# Altium project SERIALIO.PRJPCB
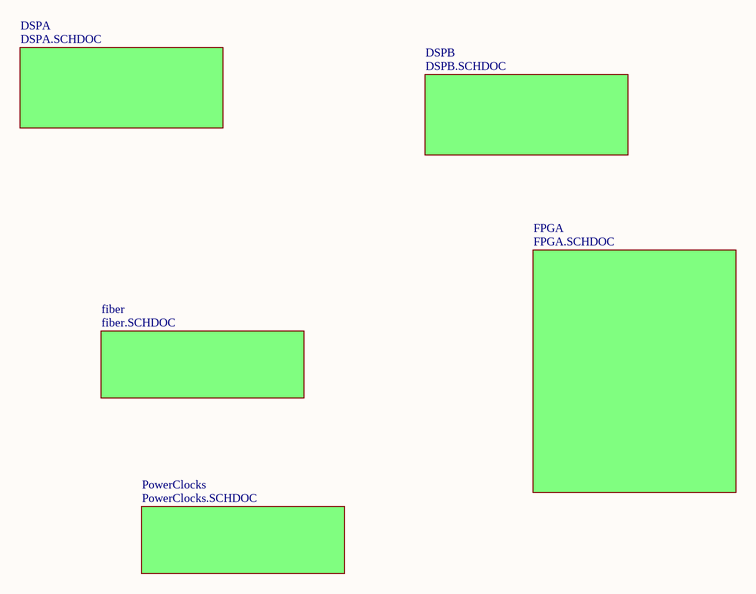
[diagram p0: main.SCHDOC]
4 sheets, 101 parts. Net scope: global (net labels, ports and power ports of the same name join across sheets).
Board file: SerialIO.PCBDOC
Sheets:
  main.SCHDOC
    fiber = fiber.SCHDOC
    FPGA = FPGA.SCHDOC
    PowerClocks = PowerClocks.SCHDOC

## Sheet main.SCHDOC
size B

### Sub-sheets
DSPA = DSPA.SCHDOC (file not in this document): no entries
DSPB = DSPB.SCHDOC (file not in this document): no entries
fiber = fiber.SCHDOC: no entries
FPGA = FPGA.SCHDOC: no entries
PowerClocks = PowerClocks.SCHDOC: no entries

### Notes on the sheet
- Title:
- Engineer:
- Date:
- Revision:
- Sheet
- of
- File:

## Sheet fiber.SCHDOC
size B
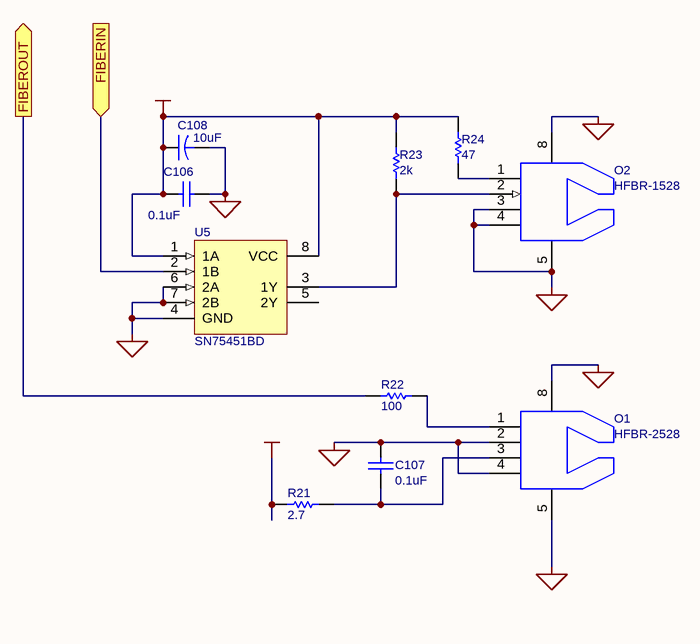
[diagram p1: fiber.SCHDOC]

### Parts
C106  value 0.1uF  [CC1005-0402]  (hidden comment: Cap)
C107  value 0.1uF  [CC1005-0402]  (hidden comment: Cap)
C108  value 10uF  [TC3528-1411]
O1  HFBR-2528  [HPVL]
O2  HFBR-1528  [HPVL]
R21  value 2.7  [CR1608-0603]  (hidden comment: Res1)
R22  value 100  [CR1608-0603]  (hidden comment: Res1)
R23  value 2k  [CR1608-0603]  (hidden comment: Res1)
R24  value 47  [CR1608-0603]  (hidden comment: Res1)
U5  SN75451BD  [SO-G8/E2.5]

### Ports
FIBERIN (in), FIBEROUT (out)

### Nets
+5VCC: C106.1 C108.1 R21.1 R23.2 R24.2 U5.1(1A) U5.8(VCC)
GND: C106.2 C107.2 C108.2 O1.2 O1.4 O1.5 O1.8 O2.3 O2.4 O2.5 O2.8 U5.4(GND) U5.6(2A) U5.7(2B)
NetC107_1: C107.1 O1.3 R21.2
NetO1_1: O1.1 R22.2
NetO2_1: O2.1 R24.1
NetO2_2: O2.2 R23.1 U5.3(1Y)
NetR22_1: R22.1 ; port FIBEROUT
NetU1_50: U5.2(1B) ; port FIBERIN

Not connected (* = marked no-connect by the designer): U5 5(2Y)

### Notes on the sheet
- Title:
- Engineer:
- Date:
- Revision:
- Sheet
- of
- File:

### Library data of the parts
C106 C107 = Cap: Capacitor; Manufacturer: Generic Components; Class I: Passive; Published: 8-Jun-2000; Revision: July-2002: Re-released for DXP Platform.; Publisher: Altium Limited; Class II: Capacitor
C108 = Cap2: Capacitor; Manufacturer: Generic Components; Class I: Passive; Published: 23-Sep-2002; Publisher: Altium Limited; Class II: Capacitor
O1 = HFBR-2528: Low-cost fiber receiver
O2 = HFBR-1528: Low-cost fiber transmitter
R21-R24 = Res1: Resistor; Manufacturer: Generic Components; Class I: Passive; Published: 8-Jun-2000; Revision: July-2002: Re-released for DXP Platform.; Publisher: Altium Limited; Class II: Resistor
U5 = SN75451BD: Dual Peripheral Driver; Manufacturer: Texas Instruments; Package Information: Latest Revision: Jan-1998; Class I: Interface; Published: 15-May-2002; Datasheet: 1991 Interface Circuits Data Book (May-1990); Package Reference: D008; Publisher: Altium Limited; Class II: Peripheral Driver

## Sheet FPGA.SCHDOC
size B
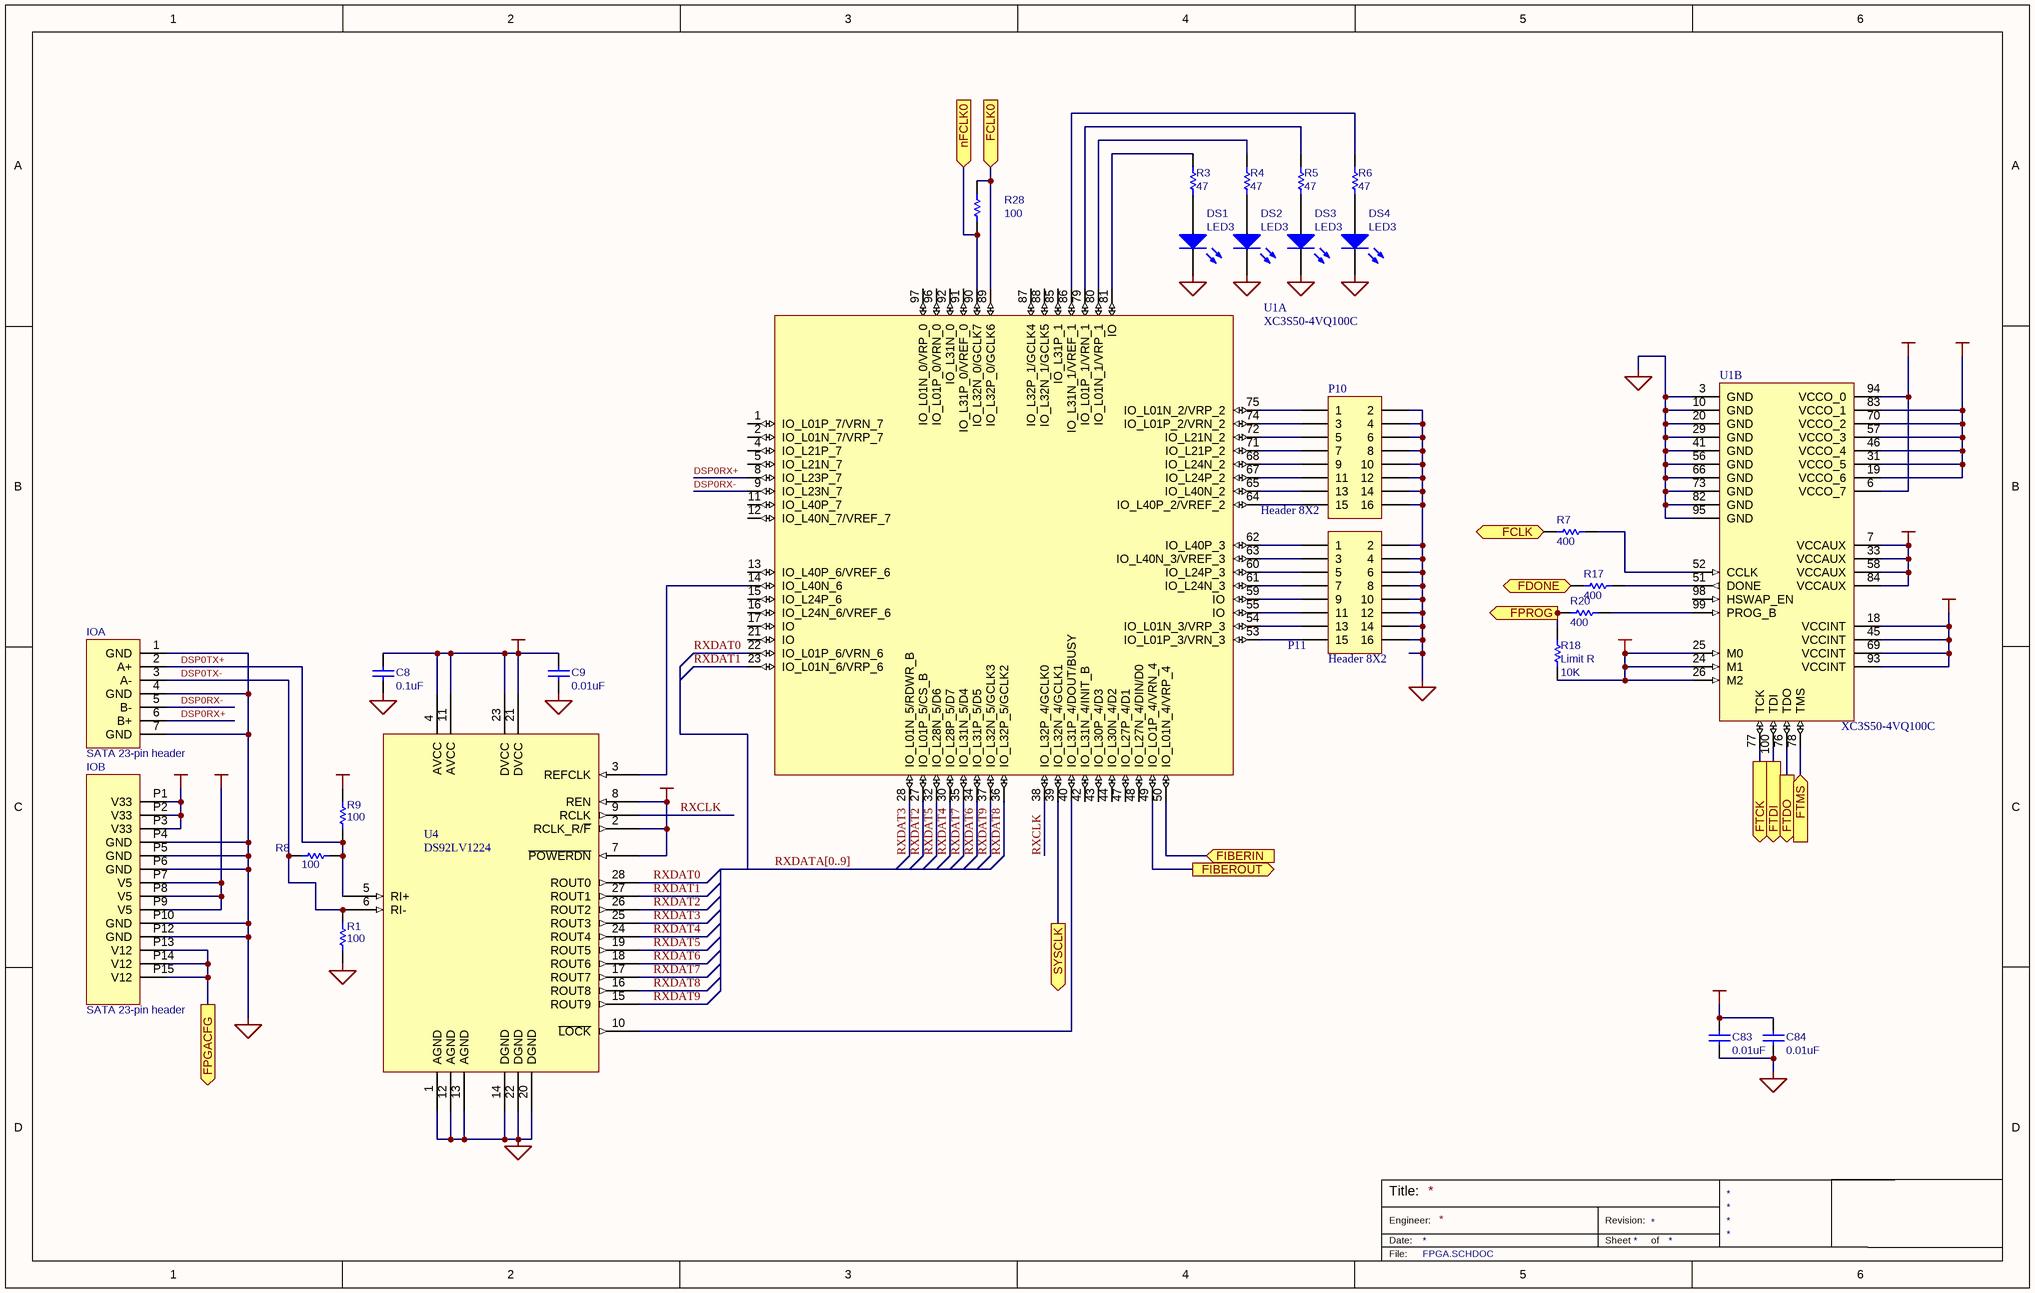
[diagram p2: FPGA.SCHDOC]

### Parts
C8  value 0.1uF  [CC1005-0402]  (hidden comment: Cap)
C9  value 0.01uF  [CC1005-0402]  (hidden comment: Cap)
C83  value 0.01uF  [CC1005-0402]  (hidden comment: Cap)
C84  value 0.01uF  [CC1005-0402]  (hidden comment: Cap)
DS1  LED3  [SMD _LED]
DS2  LED3  [SMD _LED]
DS3  LED3  [SMD _LED]
DS4  LED3  [SMD _LED]
IO  SATA 23-pin header  [MOLEX 87703-0001]  (parts A,B of 2)
P10  Header 8X2  [HDR2X8]
P11  Header 8X2  [HDR2X8]
R1  100  [CR1005-0402]
R3  value 47  [CR1608-0603]  (hidden comment: Res1)
R4  value 47  [CR1608-0603]  (hidden comment: Res1)
R5  value 47  [CR1608-0603]  (hidden comment: Res1)
R6  value 47  [CR1608-0603]  (hidden comment: Res1)
R7  value 400  [CR1608-0603]  (hidden comment: Res1)
R8  100  [CR1005-0402]
R9  100  [CR1005-0402]
R17  value 400  [CR1608-0603]  (hidden comment: Res1)
R18  Limit R  value 10K  [CR1608-0603]
R20  value 400  [CR1608-0603]  (hidden comment: Res1)
R28  100  [CR1005-0402]
U1  XC3S50-4VQ100C  [Xilinx TQ100]  (parts A,B of 2)
U4  DS92LV1224  [SSO-G28/E4.3]

### Ports
FCLK0 (in), FCLK (out), FDONE (out), FIBERIN (in), FIBEROUT (out), FPGACFG (out), FPROG (out), FTCK (out), FTDI (out), FTDO (out), FTMS (in), nFCLK0 (in), SYSCLK (out)

### Nets
+1.2VCC: U1.18(VCCINT) U1.45(VCCINT) U1.69(VCCINT) U1.93(VCCINT)
+2.5VCC: U1.6(VCCO_7) U1.7(VCCAUX) U1.33(VCCAUX) U1.58(VCCAUX) U1.84(VCCAUX) U1.94(VCCO_0)
+5VCC: IO.P7(V5) IO.P8(V5) IO.P9(V5)
GND: C8.1 C9.1 C83.1 C84.1 DS1.2(K) DS2.2(K) DS3.2(K) DS4.2(K) IO.1(GND) IO.4(GND) IO.7(GND) IO.P4(GND) IO.P5(GND) IO.P6(GND) IO.P10(GND) IO.P12(GND) P10.2 P10.4 P10.6 P10.8 P10.10 P10.12 P10.14 P10.16 P11.2 P11.4 P11.6 P11.8 P11.10 P11.12 P11.14 P11.16 R1.1 U1.3(GND) U1.10(GND) U1.20(GND) U1.29(GND) U1.41(GND) U1.56(GND) U1.66(GND) U1.73(GND) U1.82(GND) U1.95(GND) U4.1(AGND) U4.12(AGND) U4.13(AGND) U4.14(DGND) U4.20(DGND) U4.22(DGND)
VCC: C8.2 C9.2 C83.2 C84.2 IO.P1(V33) IO.P2(V33) IO.P3(V33) R9.1 R18.2 U1.19(VCCO_6) U1.24(M1) U1.25(M0) U1.26(M2) U1.31(VCCO_5) U1.46(VCCO_4) U1.57(VCCO_3) U1.70(VCCO_2) U1.83(VCCO_1) U4.2(RCLK_R/~{F}) U4.4(AVCC) U4.7(~{POWERDN}) U4.8(REN) U4.11(AVCC) U4.21(DVCC) U4.23(DVCC)
DSP0RX+: IO.6(B+) U1.8(IO_L23P_7)
DSP0RX-: IO.5(B-) U1.9(IO_L23N_7)
DSP0TX+: IO.2(A+) R8.2 R9.2 U4.5(RI+)
DSP0TX-: IO.3(A-) R1.2 R8.1 U4.6(RI-)
RXCLK: U1.38(IO_L32P_4/GCLK0) U4.9(RCLK)
RXDAT0: U1.22(IO_L01P_6/VRN_6) U4.28(ROUT0)
RXDAT1: U1.23(IO_L01N_6/VRP_6) U4.27(ROUT1)
RXDAT2: U1.27(IO_L01P_5/CS_B) U4.26(ROUT2)
RXDAT3: U1.28(IO_L01N_5/RDWR_B) U4.25(ROUT3)
RXDAT4: U1.30(IO_L28P_5/D7) U4.24(ROUT4)
RXDAT5: U1.32(IO_L28N_5/D6) U4.19(ROUT5)
RXDAT6: U1.34(IO_L31P_5/D5) U4.18(ROUT6)
RXDAT7: U1.35(IO_L31N_5/D4) U4.17(ROUT7)
RXDAT8: U1.36(IO_L32P_5/GCLK2) U4.16(ROUT8)
RXDAT9: U1.37(IO_L32N_5/GCLK3) U4.15(ROUT9)
TDO: U1.76(TDO) ; port FTDO
NetDS1_1: DS1.1(A) R3.2
NetDS2_1: DS2.1(A) R4.2
NetDS3_1: DS3.1(A) R5.2
NetDS4_1: DS4.1(A) R6.2
NetIO_P13: IO.P13(V12) IO.P14(V12) IO.P15(V12) ; port FPGACFG
NetO3_3: U1.39(IO_L32N_4/GCLK1) ; port SYSCLK
NetP10_1: P10.1 U1.75(IO_L01N_2/VRP_2)
NetP10_3: P10.3 U1.74(IO_L01P_2/VRN_2)
NetP10_5: P10.5 U1.72(IO_L21N_2)
NetP10_7: P10.7 U1.71(IO_L21P_2)
NetP10_9: P10.9 U1.68(IO_L24N_2)
NetP10_11: P10.11 U1.67(IO_L24P_2)
NetP10_13: P10.13 U1.65(IO_L40N_2)
NetP10_15: P10.15 U1.64(IO_L40P_2/VREF_2)
NetP11_1: P11.1 U1.62(IO_L40P_3)
NetP11_3: P11.3 U1.63(IO_L40N_3/VREF_3)
NetP11_5: P11.5 U1.60(IO_L24P_3)
NetP11_7: P11.7 U1.61(IO_L24N_3)
NetP11_9: P11.9 U1.59(IO)
NetP11_11: P11.11 U1.55(IO)
NetP11_13: P11.13 U1.54(IO_L01N_3/VRP_3)
NetP11_15: P11.15 U1.53(IO_L01P_3/VRN_3)
NetR3_1: R3.1 U1.81(IO)
NetR4_1: R4.1 U1.80(IO_L01N_1/VRP_1)
NetR5_1: R5.1 U1.79(IO_L01P_1/VRN_1)
NetR6_1: R6.1 U1.86(IO_L31N_1/VREF_1)
NetR7_1: R7.1 U1.52(CCLK)
NetR7_2: R7.2 ; port FCLK
NetR10_2: U1.77(TCK) ; port FTCK
NetR12_2: U1.100(TDI) ; port FTDI
NetR13_1: U1.78(TMS) ; port FTMS
NetR17_1: R17.1 U1.51(DONE)
NetR17_2: R17.2 ; port FDONE
NetR18_1: R18.1 R20.2 ; port FPROG
NetR20_1: R20.1 U1.99(PROG_B)
NetR22_1: U1.49(IO_LO1P_4/VRN_4) ; port FIBEROUT
NetR28_1: R28.1 U1.90(IO_L32N_0/GCLK7) ; port nFCLK0
NetR28_2: R28.2 U1.89(IO_L32P_0/GCLK6) ; port FCLK0
NetU1_14: U1.14(IO_L40N_6) U4.3(REFCLK)
NetU1_40: U1.40(IO_L31P_4/DOUT/BUSY) U4.10(~{LOCK})
NetU1_50: U1.50(IO_L01N_4/VRP_4) ; port FIBERIN

Not connected (* = marked no-connect by the designer): U1 1(IO_L01P_7/VRN_7) 2(IO_L01N_7/VRP_7) 4(IO_L21P_7) 5(IO_L21N_7) 11(IO_L40P_7) 12(IO_L40N_7/VREF_7) 13(IO_L40P_6/VREF_6) 15(IO_L24P_6) 16(IO_L24N_6/VREF_6) 17(IO) 21(IO) 42(IO_L31N_4/INIT_B) 43(IO_L30P_4/D3) 44(IO_L30N_4/D2) 47(IO_L27P_4/D1) 48(IO_L27N_4/DIN/D0) 85(IO_L31P_1) 87(IO_L32P_1/GCLK4) 88(IO_L32N_1/GCLK5) 91(IO_L31P_0/VREF_0) 92(IO_L31N_0) 96(IO_L01P_0/VRN_0) 97(IO_L01N_0/VRP_0) 98(HSWAP_EN)

### Buses and harness runs
bus RXDATA[0..9]

### Notes on the sheet
- Title:
- Engineer:
- Date:
- Revision:
- Sheet
- of
- File:

### Library data of the parts
C8 C9 C83 C84 = Cap: as C106 on sheet fiber; Published: 8-Jun-2000; Revision: July-2002: Re-released for DXP Platform.; Publisher: Altium Limited; Class II: Capacitor
DS1-DS4 = LED3: Typical BLUE SiC LED; Published: 8-Jun-2000; LatestRevisionDate: 17-Dec-2003; LatestRevisionNote: PCB Footprint replaced.; Publisher: Altium Limited
IO = SATA-23
P10 P11 = Header 8X2: Header, 8-Pin, Dual row; LatestRevisionDate: 17-Jul-2002; LatestRevisionNote: Re-released for DXP Platform.; Publisher: Altium Limited
R1 R8 R9 R28 = Res1: Resistor; Manufacturer: Generic Components; Class I: Passive; Value: TERMVALUE; Published: 8-Jun-2000; Revision: July-2002: Re-released for DXP Platform.; Publisher: Altium Limited; Class II: Resistor
R3-R6 R18 = Res1: as R21 on sheet fiber; Published: 8-Jun-2000; Revision: July-2002: Re-released for DXP Platform.; Publisher: Altium Limited; Class II: Resistor
R7 R17 R20 = Res1: Resistor; Published: 8-Jun-2000; LatestRevisionDate: 17-Jul-2002; LatestRevisionNote: Re-released for DXP Platform.; Publisher: Altium Limited
U1 = XC3S50-4VQ100C: Xilinx Spartan-3 VQ100; Vendor: Xilinx
U4 = DS92LV1224: 30-66 MHz 10-Bit Bus LVDS Deserializer

## Sheet PowerClocks.SCHDOC
size B
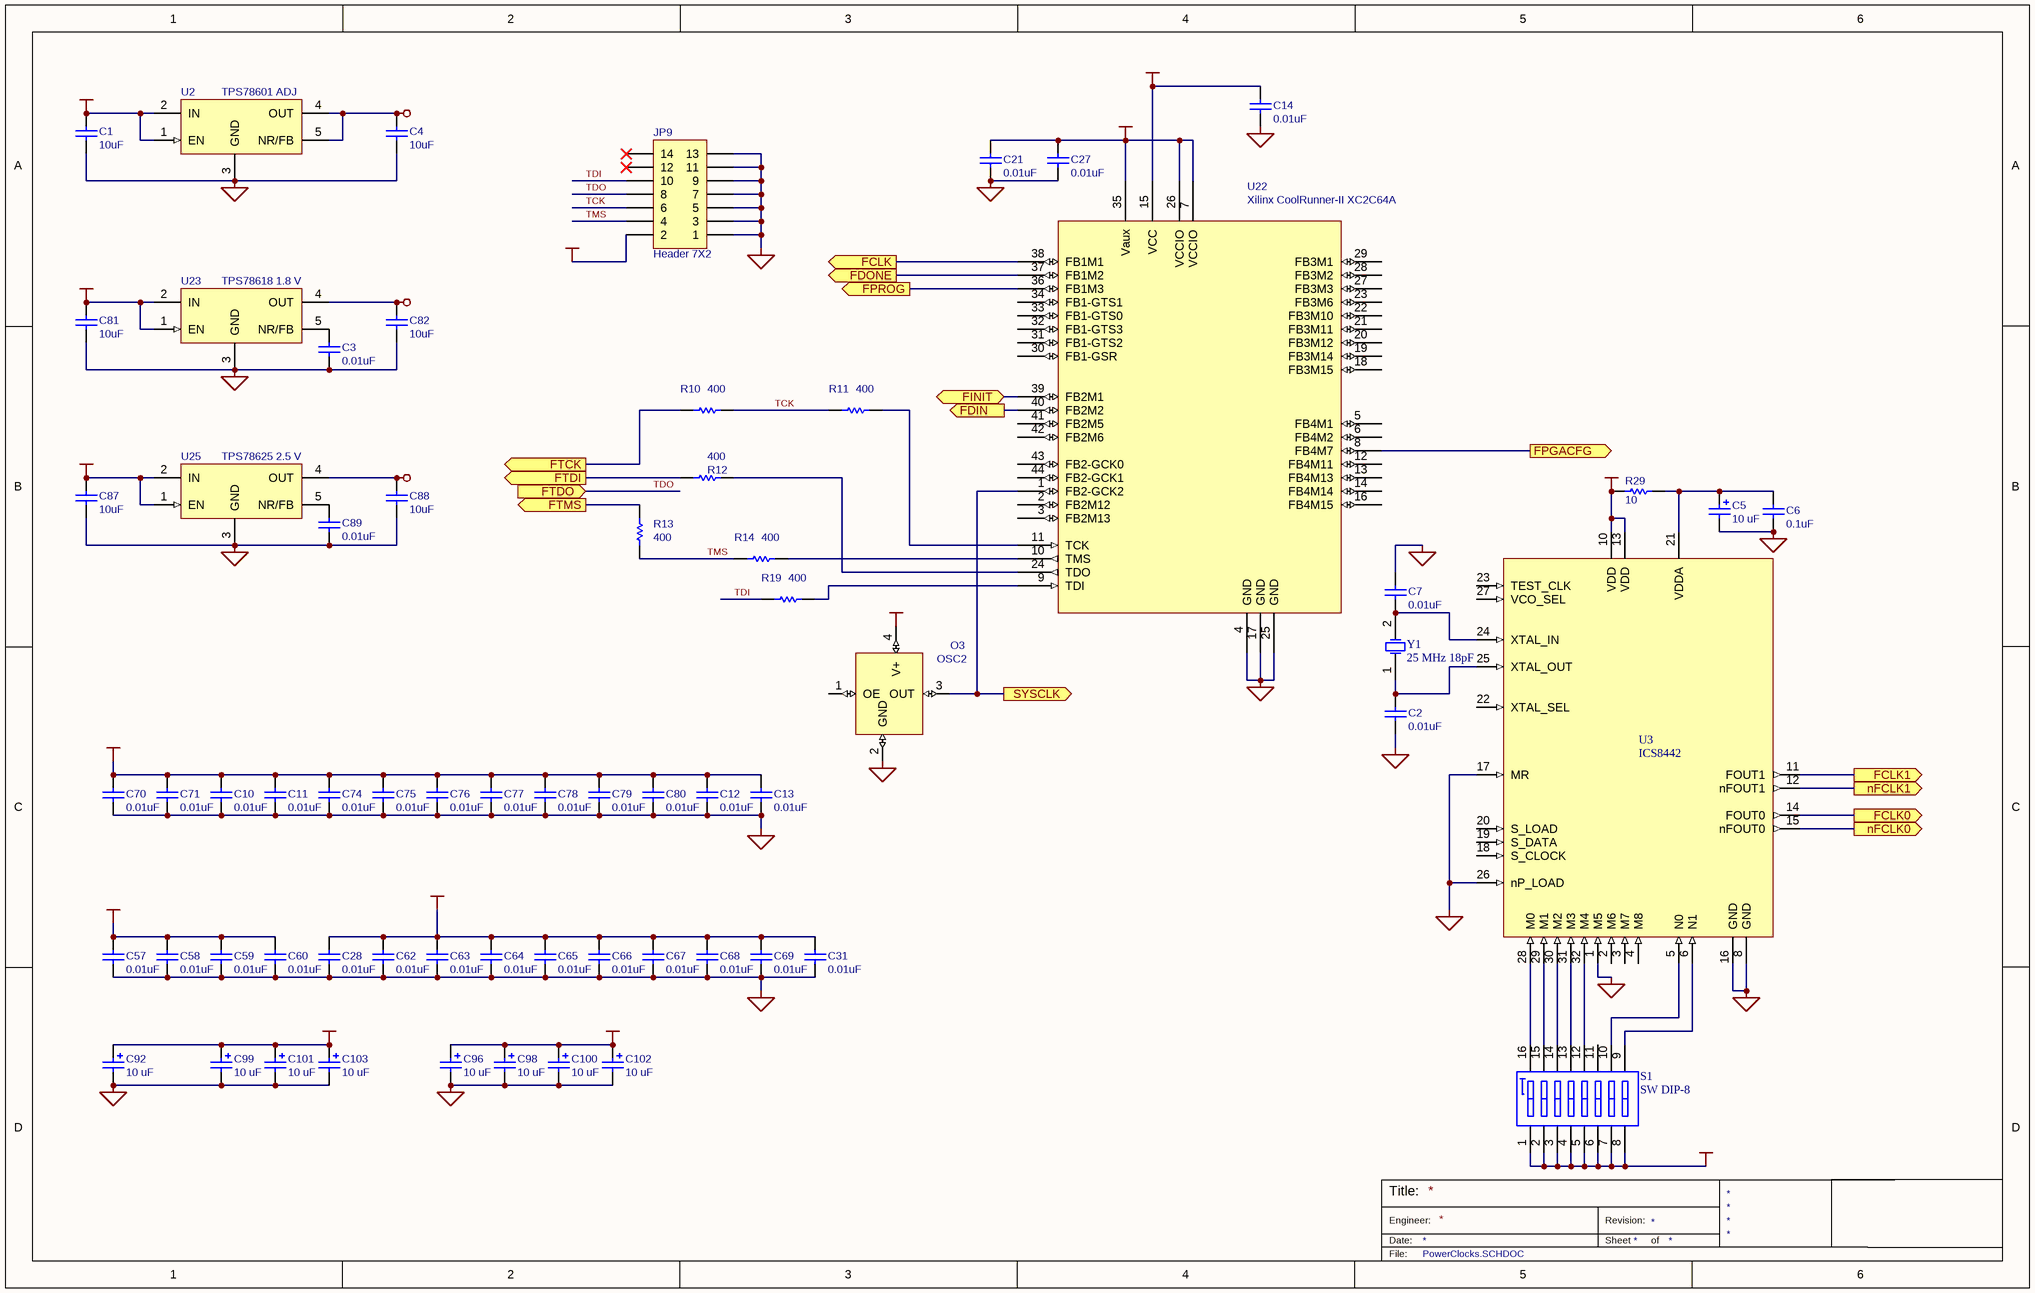
[diagram p3: PowerClocks.SCHDOC]

### Parts
C1  10uF  [CC3216-1206]
C2  value 0.01uF  [CC1005-0402]  (hidden comment: Cap)
C3  value 0.01uF  [CC1005-0402]  (hidden comment: Cap)
C4  10uF  [CC3216-1206]
C5  value 10 uF  [TC3528-1411]  (hidden comment: Bypass Cap)
C6  value 0.1uF  [CC1005-0402]  (hidden comment: Cap)
C7  value 0.01uF  [CC1005-0402]  (hidden comment: Cap)
C10  value 0.01uF  [CC1005-0402]  (hidden comment: Cap)
C11  value 0.01uF  [CC1005-0402]  (hidden comment: Cap)
C12  value 0.01uF  [CC1005-0402]  (hidden comment: Cap)
C13  value 0.01uF  [CC1005-0402]  (hidden comment: Cap)
C14  value 0.01uF  [CC1005-0402]  (hidden comment: Cap)
C21  value 0.01uF  [CC1005-0402]  (hidden comment: Cap)
C27  value 0.01uF  [CC1005-0402]  (hidden comment: Cap)
C28  value 0.01uF  [CC1005-0402]  (hidden comment: Cap)
C31  value 0.01uF  [CC1005-0402]  (hidden comment: Cap)
C57  value 0.01uF  [CC1005-0402]  (hidden comment: Cap)
C58  value 0.01uF  [CC1005-0402]  (hidden comment: Cap)
C59  value 0.01uF  [CC1005-0402]  (hidden comment: Cap)
C60  value 0.01uF  [CC1005-0402]  (hidden comment: Cap)
C62  value 0.01uF  [CC1005-0402]  (hidden comment: Cap)
C63  value 0.01uF  [CC1005-0402]  (hidden comment: Cap)
C64  value 0.01uF  [CC1005-0402]  (hidden comment: Cap)
C65  value 0.01uF  [CC1005-0402]  (hidden comment: Cap)
C66  value 0.01uF  [CC1005-0402]  (hidden comment: Cap)
C67  value 0.01uF  [CC1005-0402]  (hidden comment: Cap)
C68  value 0.01uF  [CC1005-0402]  (hidden comment: Cap)
C69  value 0.01uF  [CC1005-0402]  (hidden comment: Cap)
C70  value 0.01uF  [CC1005-0402]  (hidden comment: Cap)
C71  value 0.01uF  [CC1005-0402]  (hidden comment: Cap)
C74  value 0.01uF  [CC1005-0402]  (hidden comment: Cap)
C75  value 0.01uF  [CC1005-0402]  (hidden comment: Cap)
C76  value 0.01uF  [CC1005-0402]  (hidden comment: Cap)
C77  value 0.01uF  [CC1005-0402]  (hidden comment: Cap)
C78  value 0.01uF  [CC1005-0402]  (hidden comment: Cap)
C79  value 0.01uF  [CC1005-0402]  (hidden comment: Cap)
C80  value 0.01uF  [CC1005-0402]  (hidden comment: Cap)
C81  10uF  [CC3216-1206]
C82  10uF  [CC3216-1206]
C87  10uF  [CC3216-1206]
C88  10uF  [CC3216-1206]
C89  value 0.01uF  [CC1005-0402]  (hidden comment: Cap)
C92  value 10 uF  [TC3528-1411]  (hidden comment: Bypass Cap)
C96  value 10 uF  [TC3528-1411]  (hidden comment: Bypass Cap)
C98  value 10 uF  [TC3528-1411]  (hidden comment: Bypass Cap)
C99  value 10 uF  [TC3528-1411]  (hidden comment: Bypass Cap)
C100  value 10 uF  [TC3528-1411]  (hidden comment: Bypass Cap)
C101  value 10 uF  [TC3528-1411]  (hidden comment: Bypass Cap)
C102  value 10 uF  [TC3528-1411]  (hidden comment: Bypass Cap)
C103  value 10 uF  [TC3528-1411]  (hidden comment: Bypass Cap)
JP9  Header 7X2  [HDR2x7-2mm]
O3  OSC2  [ECS-3953M]
R10  value 400  [CR1608-0603]  (hidden comment: current-limiting series res)
R11  value 400  [CR1608-0603]  (hidden comment: current-limiting series res)
R12  value 400  [CR1608-0603]  (hidden comment: current-limiting series res)
R13  value 400  [CR1608-0603]  (hidden comment: current-limiting series res)
R14  value 400  [CR1608-0603]  (hidden comment: current-limiting series res)
R19  value 400  [CR1608-0603]  (hidden comment: current-limiting series res)
R29  value 10  [CR1608-0603]  (hidden comment: Res1)
S1  SW DIP-8  [CANNON-SDA]
U2  TPS78601 ADJ  [KTT]
U3  ICS8442  [QFP7x7-G32/N]
U22  Xilinx CoolRunner-II XC2C64A  [QFP10x10-G44/G10N]
U23  TPS78618 1.8 V  [KTT]
U25  TPS78625 2.5 V  [KTT]
Y1  25 MHz 18pF  [ECS CSM-7]

### Ports
FCLK0 (out), FCLK1 (out), FCLK (out), FDIN (out), FDONE (out), FINIT (bidir), FPGACFG (out), FPROG (out), FTCK (out), FTDI (out), FTDO (in), FTMS (out), nFCLK0 (out), nFCLK1 (out), SYSCLK (out)

### Nets
+1.2VCC: C4.2 C57.2 C58.2 C59.2 C60.2 C96.1 C98.1 C100.1 C102.1 U2.4(OUT) U2.5(NR/FB)
+1.8VCC: C14.2 C82.2 U22.15(VCC) U23.4(OUT)
+2.5VCC: C28.2 C31.2 C62.2 C63.2 C64.2 C65.2 C66.2 C67.2 C68.2 C69.2 C88.2 U25.4(OUT)
GND: C1.1 C2.1 C3.2 C4.1 C5.2 C6.1 C7.2 C10.1 C11.1 C12.1 C13.1 C14.1 C21.1 C27.1 C28.1 C31.1 C57.1 C58.1 C59.1 C60.1 C62.1 C63.1 C64.1 C65.1 C66.1 C67.1 C68.1 C69.1 C70.1 C71.1 C74.1 C75.1 C76.1 C77.1 C78.1 C79.1 C80.1 C81.1 C82.1 C87.1 C88.1 C89.2 C92.2 C96.2 C98.2 C99.2 C100.2 C101.2 C102.2 C103.2 JP9.1 JP9.3 JP9.5 JP9.7 JP9.9 JP9.11 JP9.13 O3.2(GND) U2.3(GND) U3.1(M5) U3.8(GND) U3.16(GND) U3.17(MR) U3.26(nP_LOAD) U22.4(GND) U22.17(GND) U22.25(GND) U23.3(GND) U25.3(GND)
VCC: C1.2 C10.2 C11.2 C12.2 C13.2 C21.2 C27.2 C70.2 C71.2 C74.2 C75.2 C76.2 C77.2 C78.2 C79.2 C80.2 C81.2 C87.2 C92.1 C99.1 C101.1 C103.1 JP9.2 O3.4(V+) R29.1 S1.1(A1) S1.2(A2) S1.3(A3) S1.4(A4) S1.5(A5) S1.6(A6) S1.7(A7) S1.8(A8) U2.1(EN) U2.2(IN) U3.10(VDD) U3.13(VDD) U22.7(VCCIO) U22.26(VCCIO) U22.35(Vaux) U23.1(EN) U23.2(IN) U25.1(EN) U25.2(IN)
TCK: JP9.6 R10.1 R11.2
TDI: JP9.10 R19.2
TDO: JP9.8 ; port FTDO
TMS: JP9.4 R13.2 R14.2
NetC2_2: C2.2 U3.25(XTAL_OUT) Y1.1(OSC1)
NetC3_1: C3.1 U23.5(NR/FB)
NetC5_1: C5.1 C6.2 R29.2 U3.21(VDDA)
NetC7_1: C7.1 U3.24(XTAL_IN) Y1.2(OSC2)
NetC89_1: C89.1 U25.5(NR/FB)
NetIO_P13: U22.8(FB4M7) ; port FPGACFG
NetO3_3: O3.3(OUT) U22.1(FB2-GCK2) ; port SYSCLK
NetR7_2: U22.38(FB1M1) ; port FCLK
NetR10_2: R10.2 ; port FTCK
NetR11_1: R11.1 U22.11(TCK)
NetR12_1: R12.1 U22.24(TDO)
NetR12_2: R12.2 ; port FTDI
NetR13_1: R13.1 ; port FTMS
NetR14_1: R14.1 U22.10(TMS)
NetR17_2: U22.37(FB1M2) ; port FDONE
NetR18_1: U22.36(FB1M3) ; port FPROG
NetR19_1: R19.1 U22.9(TDI)
NetR28_1: U3.15(nFOUT0) ; port nFCLK0
NetR28_2: U3.14(FOUT0) ; port FCLK0
NetS1_9: S1.9(B8) U3.6(N1)
NetS1_10: S1.10(B7) U3.5(N0)
NetS1_12: S1.12(B5) U3.32(M4)
NetS1_13: S1.13(B4) U3.31(M3)
NetS1_14: S1.14(B3) U3.30(M2)
NetS1_15: S1.15(B2) U3.29(M1)
NetS1_16: S1.16(B1) U3.28(M0)
NetU3_11: U3.11(FOUT1) ; port FCLK1
NetU3_12: U3.12(nFOUT1) ; port nFCLK1
NetU22_39: U22.39(FB2M1) ; port FINIT
NetU22_40: U22.40(FB2M2) ; port FDIN

Not connected (* = marked no-connect by the designer): JP9 12* 14*; O3 1(OE); S1 11(B6); U3 2(M6) 3(M7) 4(M8) 18(S_CLOCK) 19(S_DATA) 20(S_LOAD) 22(XTAL_SEL) 23(TEST_CLK) 27(VCO_SEL); U22 2(FB2M12) 3(FB2M13) 5(FB4M1) 6(FB4M2) 12(FB4M11) 13(FB4M13) 14(FB4M14) 16(FB4M15) 18(FB3M15) 19(FB3M14) 20(FB3M12) 21(FB3M11) 22(FB3M10) 23(FB3M6) 27(FB3M3) 28(FB3M2) 29(FB3M1) 30(FB1-GSR) 31(FB1-GTS2) 32(FB1-GTS3) 33(FB1-GTS0) 34(FB1-GTS1) 41(FB2M5) 42(FB2M6) 43(FB2-GCK0) 44(FB2-GCK1)

### Notes on the sheet
- Title:
- Engineer:
- Date:
- Revision:
- Sheet
- of
- File:

### Library data of the parts
C1 C3 C4 C81 C82 C87-C89 = Cap: Capacitor; Published: 8-Jun-2000; LatestRevisionDate: 17-Jul-2002; LatestRevisionNote: Re-released for DXP Platform.; Publisher: Altium Limited
C2 C6 C7 C10-C14 C21 C27 C28 C31 C57-C60 C62-C71 C74-C80 = Cap: as C106 on sheet fiber; Published: 8-Jun-2000; Revision: July-2002: Re-released for DXP Platform.; Publisher: Altium Limited; Class II: Capacitor
C5 C92 C96 C98-C103 = Cap Pol3: Tantalum Bypass cap; Manufacturer: Generic Components; Class I: Passive; Class II: Capacitor; Published: 8-Jun-2000; Revision: July-2002: Re-released for DXP Platform.; Publisher: Altium Limited
JP9 = Header 7X2: Header, 7-Pin, Dual row; Manufacturer: Generic Components; Class I: Connector; Vendor: MOLEX 87831-1420; Revision: July-2002: Re-released for DXP Platform.; Publisher: Altium Limited
O3 = OSC2: ECS SMD Oscillator, ECS-3953M
R10-R14 R19 R29 = Res1: as R21 on sheet fiber; Published: 8-Jun-2000; Revision: July-2002: Re-released for DXP Platform.; Publisher: Altium Limited; Class II: Resistor
S1 = SW DIP-8: DIP Switch, 8 Position, SPST; Published: 24-Mar-1999; LatestRevisionDate: 17-Jul-2002; LatestRevisionNote: Re-released for DXP Platform.; Publisher: Altium Limited
U2 U23 U25 = TPS786XX: TI 1.5A LDO
U3 = ICS8442: 700 MHx Crystal Oscillator-todifferential LVDS Freq Synth
U22 = XC2C64A-5VQ44C
Y1 = XTAL: Crystal Oscillator; Published: 8-Jun-2000; LatestRevisionDate: 17-Jul-2002; LatestRevisionNote: Re-released for DXP Platform.; PackageReference: R38; Publisher: Altium Limited

## Nets that join several sheets
+1.2VCC: FPGA (U1.18 U1.45 U1.69 U1.93), PowerClocks (11 pins)
+2.5VCC: FPGA (6 pins), PowerClocks (12 pins)
+5VCC: fiber (7 pins), FPGA (IO.P7 IO.P8 IO.P9)
GND: fiber (14 pins), FPGA (49 pins), PowerClocks (69 pins)
VCC: FPGA (25 pins), PowerClocks (44 pins)
NetIO_P13: FPGA (IO.P13 IO.P14 IO.P15), PowerClocks (U22.8)
NetO3_3: FPGA (U1.39), PowerClocks (O3.3 U22.1)
NetR7_2: FPGA (R7.2), PowerClocks (U22.38)
NetR10_2: FPGA (U1.77), PowerClocks (R10.2)
NetR12_2: FPGA (U1.100), PowerClocks (R12.2)
NetR13_1: FPGA (U1.78), PowerClocks (R13.1)
NetR17_2: FPGA (R17.2), PowerClocks (U22.37)
NetR18_1: FPGA (R18.1 R20.2), PowerClocks (U22.36)
NetR22_1: fiber (R22.1), FPGA (U1.49)
NetR28_1: FPGA (R28.1 U1.90), PowerClocks (U3.15)
NetR28_2: FPGA (R28.2 U1.89), PowerClocks (U3.14)
NetU1_50: fiber (U5.2), FPGA (U1.50)
TDO: FPGA (U1.76), PowerClocks (JP9.8)